# EAGLE schematic sensor (EAGLE 8.0.1)
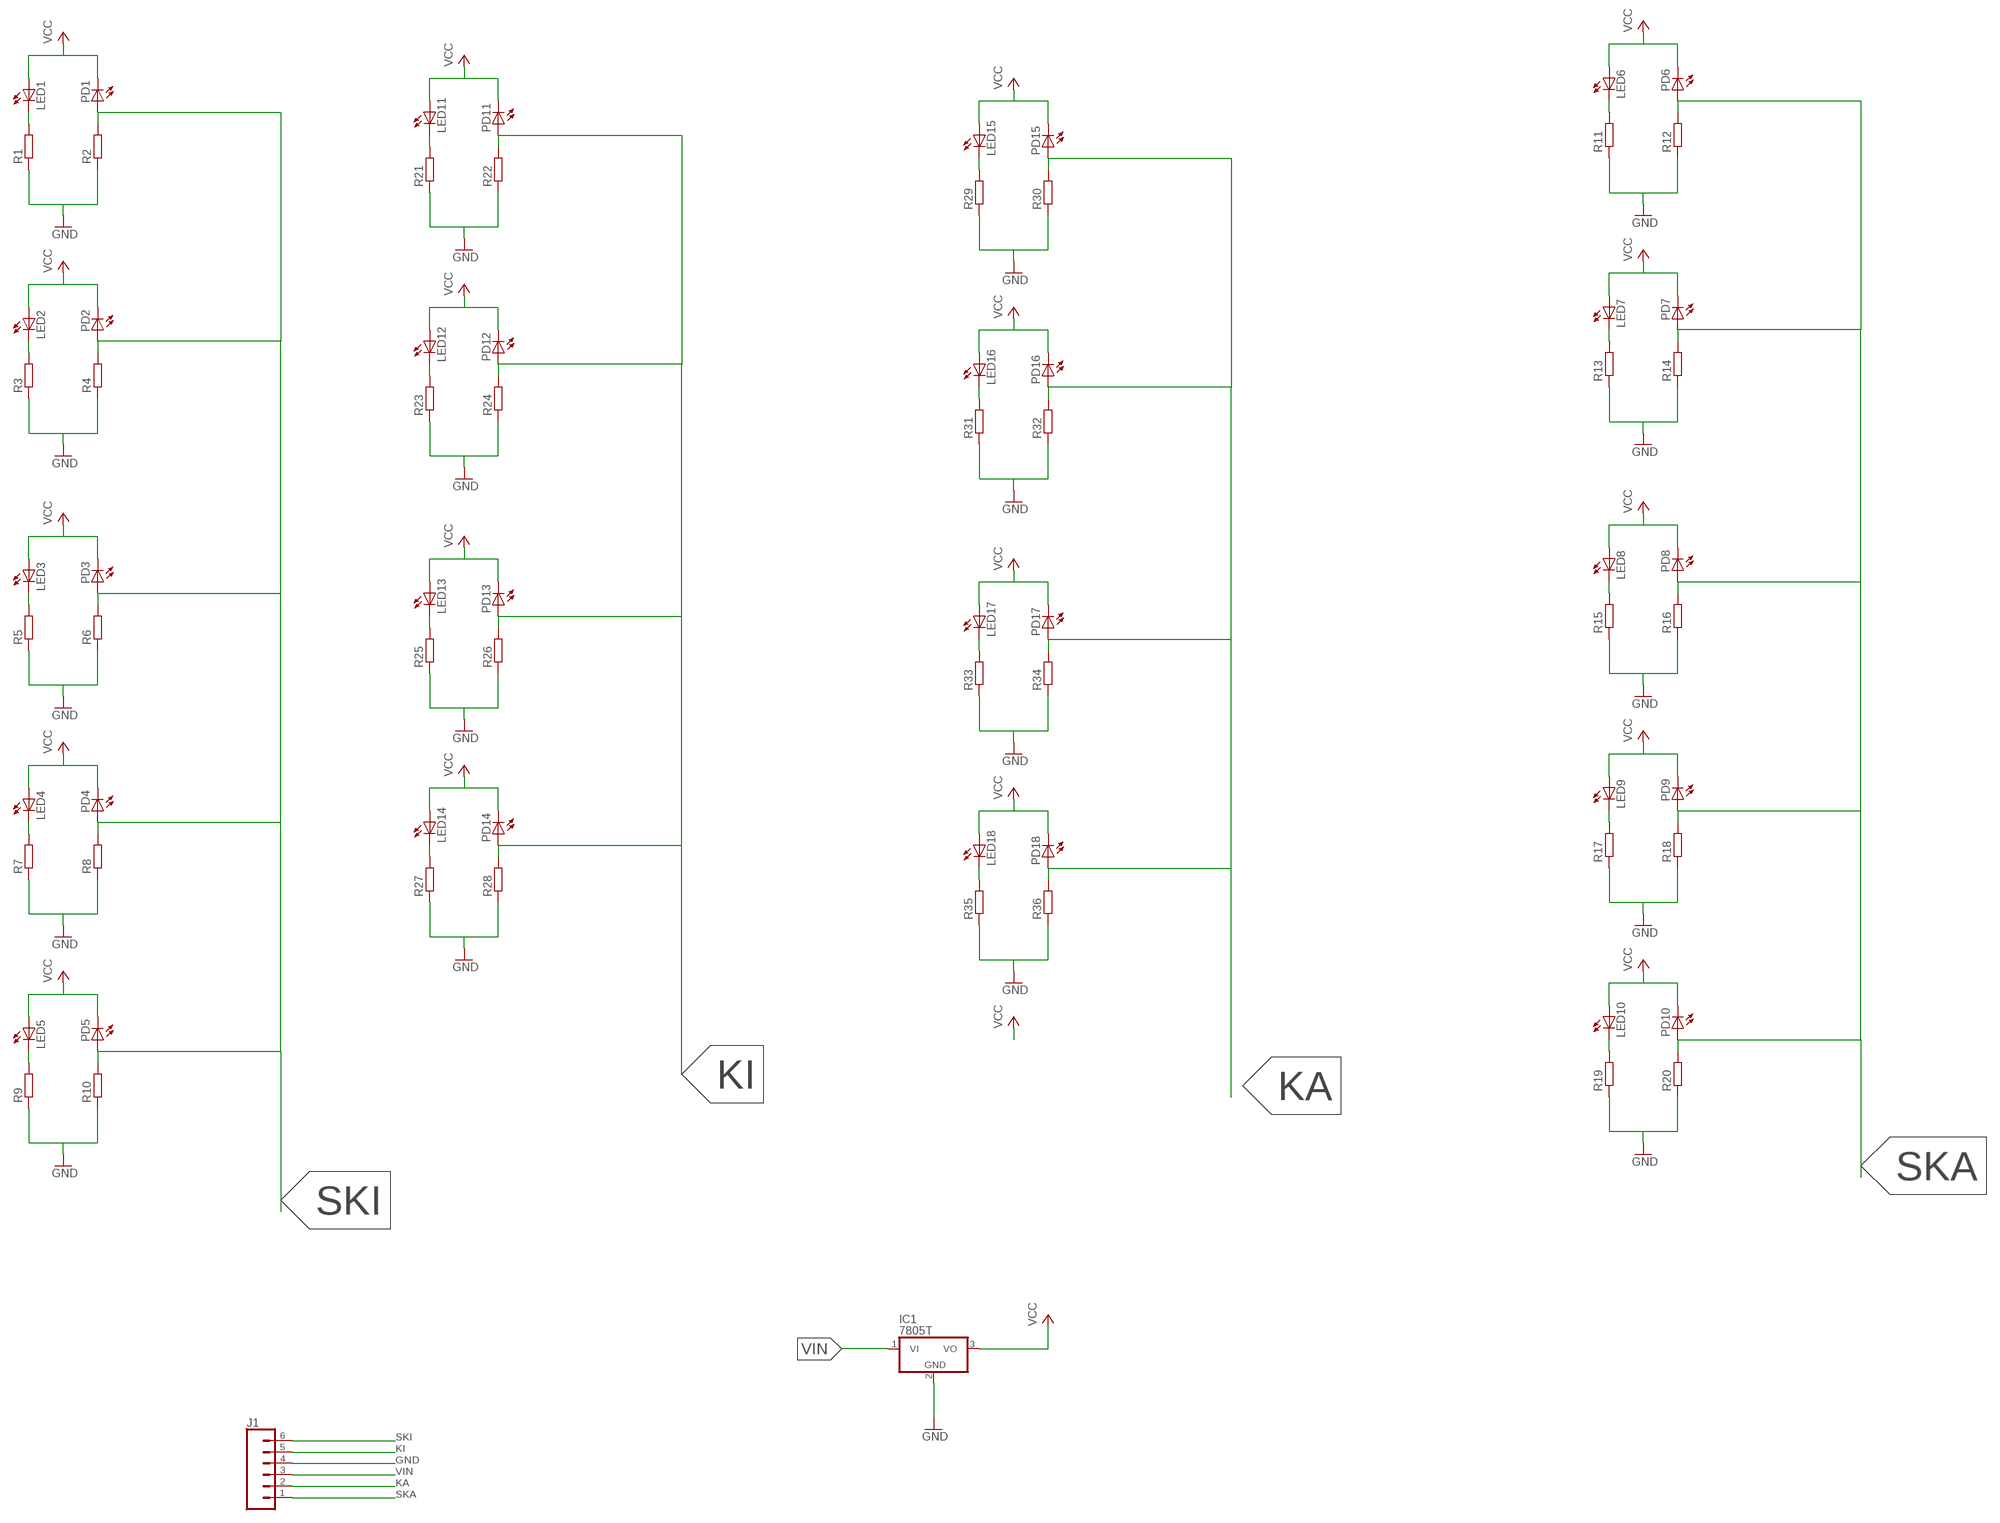
[diagram p0: schematic, sheet 1]

## Parts
IC1  7805T  [TO220H]
J1  CONN_06LONGPADS  [1X06_LONGPADS]
LED1  LED5MM  [LED5MM]
LED2  LED5MM  [LED5MM]
LED3  LED5MM  [LED5MM]
LED4  LED5MM  [LED5MM]
LED5  LED5MM  [LED5MM]
LED6  LED5MM  [LED5MM]
LED7  LED5MM  [LED5MM]
LED8  LED5MM  [LED5MM]
LED9  LED5MM  [LED5MM]
LED10  LED5MM  [LED5MM]
LED11  LED5MM  [LED5MM]
LED12  LED5MM  [LED5MM]
LED13  LED5MM  [LED5MM]
LED14  LED5MM  [LED5MM]
LED15  LED5MM  [LED5MM]
LED16  LED5MM  [LED5MM]
LED17  LED5MM  [LED5MM]
LED18  LED5MM  [LED5MM]
PD1  LED3MM  [LED3MM]
PD2  LED3MM  [LED3MM]
PD3  LED3MM  [LED3MM]
PD4  LED3MM  [LED3MM]
PD5  LED3MM  [LED3MM]
PD6  LED3MM  [LED3MM]
PD7  LED3MM  [LED3MM]
PD8  LED3MM  [LED3MM]
PD9  LED3MM  [LED3MM]
PD10  LED3MM  [LED3MM]
PD11  LED3MM  [LED3MM]
PD12  LED3MM  [LED3MM]
PD13  LED3MM  [LED3MM]
PD14  LED3MM  [LED3MM]
PD15  LED3MM  [LED3MM]
PD16  LED3MM  [LED3MM]
PD17  LED3MM  [LED3MM]
PD18  LED3MM  [LED3MM]
R1  R-EU_0204/7  [0204/7]
R2  R-EU_0204/7  [0204/7]
R3  R-EU_0204/7  [0204/7]
R4  R-EU_0204/7  [0204/7]
R5  R-EU_0204/7  [0204/7]
R6  R-EU_0204/7  [0204/7]
R7  R-EU_0204/7  [0204/7]
R8  R-EU_0204/7  [0204/7]
R9  R-EU_0204/7  [0204/7]
R10  R-EU_0204/7  [0204/7]
R11  R-EU_0204/7  [0204/7]
R12  R-EU_0204/7  [0204/7]
R13  R-EU_0204/7  [0204/7]
R14  R-EU_0204/7  [0204/7]
R15  R-EU_0204/7  [0204/7]
R16  R-EU_0204/7  [0204/7]
R17  R-EU_0204/7  [0204/7]
R18  R-EU_0204/7  [0204/7]
R19  R-EU_0204/7  [0204/7]
R20  R-EU_0204/7  [0204/7]
R21  R-EU_0204/7  [0204/7]
R22  R-EU_0204/7  [0204/7]
R23  R-EU_0204/7  [0204/7]
R24  R-EU_0204/7  [0204/7]
R25  R-EU_0204/7  [0204/7]
R26  R-EU_0204/7  [0204/7]
R27  R-EU_0204/7  [0204/7]
R28  R-EU_0204/7  [0204/7]
R29  R-EU_0204/7  [0204/7]
R30  R-EU_0204/7  [0204/7]
R31  R-EU_0204/7  [0204/7]
R32  R-EU_0204/7  [0204/7]
R33  R-EU_0204/7  [0204/7]
R34  R-EU_0204/7  [0204/7]
R35  R-EU_0204/7  [0204/7]
R36  R-EU_0204/7  [0204/7]

## Nets
GND: IC1.2(GND) J1.4 R1.1 R2.1 R3.1 R4.1 R5.1 R6.1 R7.1 R8.1 R9.1 R10.1 R11.1 R12.1 R13.1 R14.1 R15.1 R16.1 R17.1 R18.1 R19.1 R20.1 R21.1 R22.1 R23.1 R24.1 R25.1 R26.1 R27.1 R28.1 R29.1 R30.1 R31.1 R32.1 R33.1 R34.1 R35.1 R36.1
KA: J1.2 PD15.A PD16.A PD17.A PD18.A R30.2 R32.2 R34.2 R36.2
KI: J1.5 PD11.A PD12.A PD13.A PD14.A R22.2 R24.2 R26.2 R28.2
N$1: LED1.K(C) R1.2
N$2: LED6.K(C) R11.2
N$3: LED2.K(C) R3.2
N$4: LED7.K(C) R13.2
N$5: LED3.K(C) R5.2
N$6: LED8.K(C) R15.2
N$7: LED4.K(C) R7.2
N$8: LED9.K(C) R17.2
N$9: LED5.K(C) R9.2
N$11: LED10.K(C) R19.2
N$13: LED11.K(C) R21.2
N$14: LED12.K(C) R23.2
N$15: LED13.K(C) R25.2
N$16: LED14.K(C) R27.2
N$18: LED15.K(C) R29.2
N$19: LED16.K(C) R31.2
N$20: LED17.K(C) R33.2
N$21: LED18.K(C) R35.2
SKA: J1.1 PD6.A PD7.A PD8.A PD9.A PD10.A R12.2 R14.2 R16.2 R18.2 R20.2
SKI: J1.6 PD1.A PD2.A PD3.A PD4.A PD5.A R2.2 R4.2 R6.2 R8.2 R10.2
VCC: IC1.3(VO) LED1.A LED2.A LED3.A LED4.A LED5.A LED6.A LED7.A LED8.A LED9.A LED10.A LED11.A LED12.A LED13.A LED14.A LED15.A LED16.A LED17.A LED18.A PD1.K(C) PD2.K(C) PD3.K(C) PD4.K(C) PD5.K(C) PD6.K(C) PD7.K(C) PD8.K(C) PD9.K(C) PD10.K(C) PD11.K(C) PD12.K(C) PD13.K(C) PD14.K(C) PD15.K(C) PD16.K(C) PD17.K(C) PD18.K(C)
VIN: IC1.1(VI) J1.3

## Library data of the parts
IC1 = linear:78*: Positive VOLTAGE REGULATOR Source: http://cache.national.com/ds/LM/LM78L05.pdf http://www.fairchildsemi.com/ds/LM/LM7805.pdf
J1 = SparkFun-Connectors:CONN_06: Multi connection point. Often used as Generic Header-pin footprint for 0.1 inch spaced/style header connections On any of the 0.1 inch spaced packages, you can populate with these: Break Away Headers - Straight <https://www.sparkfun.com/products/116> (PRT-00116) Break Away Male Headers - Right Angle <https://www.sparkfun.com/products/553> (PRT-00553) Female Headers <https://www.sparkfun.com/products/115> (PRT-00115) Break Away Headers - Machine Pin <https://www.sparkfun.com/products/117> (PRT-00117) Break Away Female Headers - Swiss Machine Pin <https://www.sparkfun.com/products/743> (PRT-00743) Arduino Stackable Header - 6 Pin <https://www.sparkfun.com/products/9280> (PRT-09280) For SCREWTERMINALS and SPRING TERMINALS visit here: Screw Terimnals on SparkFun.com <https://www.sparkfun.com/search/results?term=Screw+Terminals> (5mm/3.5mm/2.54mm spacing) This device is also useful as a general connection point to wire up your design to another part of your project. Our various solder wires solder well into these plated through hole pads. Hook-Up Wire - Assortment (Stranded, 22 AWG) <https://www.sparkfun.com/products/11375> (PRT-11375) Hook-Up Wire - Assortment (Solid Core, 22 AWG) <https://www.sparkfun.com/products/11367> (PRT-11367) View the entire wire category on our website here <https://www.sparkfun.com/categories/141>
LED1-LED18 PD1-PD18 = led:LED: LED OSRAM: - CHIPLED LG R971, LG N971, LY N971, LG Q971, LY Q971, LO R971, LY R971 LH N974, LH R974 LS Q976, LO Q976, LY Q976 LO Q996 - Hyper CHIPLED LW Q18S LB Q993, LB Q99A, LB R99A - SideLED LS A670, LO A670, LY A670, LG A670, LP A670 LB A673, LV A673, LT A673, LW A673 LH A674 LY A675 LS A676, LA A676, LO A676, LY A676, LW A676 LS A679, LY A679, LG A679 - Hyper Micro SIDELED® LS Y876, LA Y876, LO Y876, LY Y876 LT Y87S - SmartLED LW L88C, LW L88S LB L89C, LB L89S, LG L890 LS L89K, LO L89K, LY L89K LS L896, LA L896, LO L896, LY L896 - TOPLED LS T670, LO T670, LY T670, LG T670, LP T670 LSG T670, LSP T670, LSY T670, LOP T670, LYG T670 LG T671, LOG T671, LSG T671 LB T673, LV T673, LT T673, LW T673 LH T674 LS T676, LA T676, LO T676, LY T676, LB T676, LH T676, LSB T676, LW T676 LB T67C, LV T67C, LT T67C, LS T67K, LO T67K, LY T67K, LW E67C LS E67B, LA E67B, LO E67B, LY E67B, LB E67C, LV E67C, LT E67C LW T67C LS T679, LY T679, LG T679 LS T770, LO T770, LY T770, LG T770, LP T770 LB T773, LV T773, LT T773, LW T773 LH T774 LS E675, LA E675, LY E675, LS T675 LS T776, LA T776, LO T776, LY T776, LB T776 LHGB T686 LT T68C, LB T68C - Hyper Mini TOPLED® LB M676 - Mini TOPLED Santana® LG M470 LS M47K, LO M47K, LY M47K Source: http://www.osram.convergy.de LUXEON: - LUMILED® LXK2-PW12-R00, LXK2-PW12-S00, LXK2-PW14-U00, LXK2-PW14-V00 LXK2-PM12-R00, LXK2-PM12-S00, LXK2-PM14-U00 LXK2-PE12-Q00, LXK2-PE12-R00, LXK2-PE12-S00, LXK2-PE14-T00, LXK2-PE14-U00 LXK2-PB12-K00, LXK2-PB12-L00, LXK2-PB12-M00, LXK2-PB14-N00, LXK2-PB14-P00, LXK2-PB14-Q00 LXK2-PR12-L00, LXK2-PR12-M00, LXK2-PR14-Q00, LXK2-PR14-R00 LXK2-PD12-Q00, LXK2-PD12-R00, LXK2-PD12-S00 LXK2-PH12-R00, LXK2-PH12-S00 LXK2-PL12-P00, LXK2-PL12-Q00, LXK2-PL12-R00 Source: www.luxeon.com KINGBRIGHT: KA-3528ASYC Source: www.kingbright.com
R1-R36 = resistor:R-EU_: RESISTOR, European symbol